# Altium schematic sheet T245_1v1.SchDoc
size 254 x 203 mm; Author: Aurimas Vilkas; DrawnBy: Aurimas Vilkas; Engineer: Aurimas Vilkas
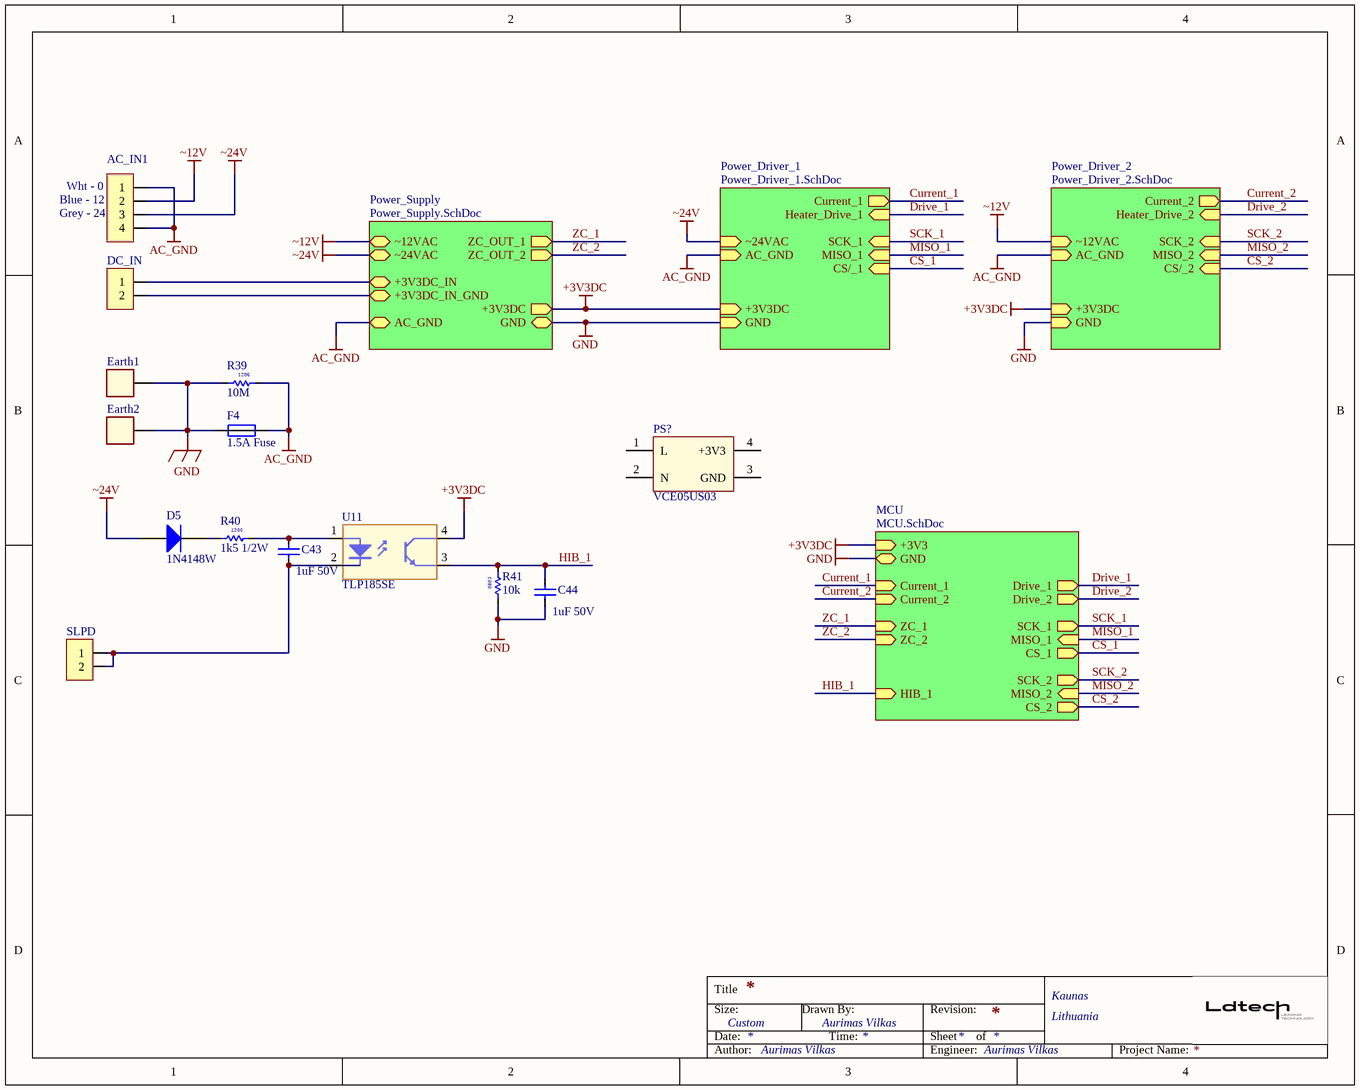
[diagram p0: T245_1v1.SchDoc]

## Parts
AC_IN1  HDR1X4  [HDR1X4_3M96V]  (value not drawn)
C43  1uF 50V  [CAPC2012N]
C44  1uF 50V  [CAPC2012N]
D5  1N4148W  [SOD-123F]
DC_IN  HDR1X2  [HDR1X2_3M96V]  (value not drawn)
Earth1  Blade Header  [Blade header]  (value not drawn)
Earth2  Blade Header  [Blade header]  (value not drawn)
F4  1.5A Fuse  [1206F]
PS?  VCE05US03  [VCE05US03]
R39  10M  [RESC3216N]
R40  1k5 1/2W  [RESC3216N]
R41  10k  [RESC1608N]
SLPD  Sleep_Det  [HDR1X2_2.54mm]  (value not drawn)
U11  TLP185SE  [SOP-4]

## Sub-sheets
MCU = MCU.SchDoc: SCK_2 (out), +3V3 (in), Current_1 (in), Drive_2 (out), CS_1 (out), Current_2 (in), MISO_1 (in), MISO_2 (in), ZC_2 (in), CS_2 (out), SCK_1 (out), ZC_1 (in), Drive_1 (out), GND (bidir), HIB_1 (in)
Power_Driver_1 = Power_Driver_1.SchDoc: GND (in), ~24VAC (in), Current_1 (out), SCK_1 (in), +3V3DC (in), AC_GND (in), Heater_Drive_1 (in), CS/_1 (in), MISO_1 (in)
Power_Driver_2 = Power_Driver_2.SchDoc: Current_2 (out), Heater_Drive_2 (in), +3V3DC (in), AC_GND (in), MISO_2 (in), GND (in), CS/_2 (in), SCK_2 (in), ~12VAC (in)
Power_Supply = Power_Supply.SchDoc: +3V3DC (out), GND (bidir), ~24VAC (bidir), AC_GND (bidir), ZC_OUT_2 (out), ZC_OUT_1 (out), +3V3DC_IN (bidir), +3V3DC_IN_GND (bidir), ~12VAC (bidir)

## Nets
+3V3DC: U11.4(C) ; sheet MCU/+3V3, sheet Power_Supply/+3V3DC, sheet Power_Driver_1/+3V3DC, sheet Power_Driver_2/+3V3DC
AC_GND: AC_IN1.1 AC_IN1.4 F4.1 R39.2 ; sheet Power_Supply/AC_GND, sheet Power_Driver_1/AC_GND, sheet Power_Driver_2/AC_GND
GND: C44.2 Earth1.1 Earth2.1 F4.2 R39.1 R41.1 ; sheet MCU/GND, sheet Power_Supply/GND, sheet Power_Driver_1/GND, sheet Power_Driver_2/GND
~12V: AC_IN1.2 ; sheet Power_Supply/~12VAC, sheet Power_Driver_2/~12VAC
~24V: AC_IN1.3 D5.2 ; sheet Power_Supply/~24VAC, sheet Power_Driver_1/~24VAC
CS_1: sheet MCU/CS_1, sheet Power_Driver_1/CS/_1
CS_2: sheet MCU/CS_2, sheet Power_Driver_2/CS/_2
Current_1: sheet MCU/Current_1, sheet Power_Driver_1/Current_1
Current_2: sheet MCU/Current_2, sheet Power_Driver_2/Current_2
Drive_1: sheet MCU/Drive_1, sheet Power_Driver_1/Heater_Drive_1
Drive_2: sheet MCU/Drive_2, sheet Power_Driver_2/Heater_Drive_2
HIB_1: C44.1 R41.2 U11.3(E) ; sheet MCU/HIB_1
MISO_1: sheet MCU/MISO_1, sheet Power_Driver_1/MISO_1
MISO_2: sheet MCU/MISO_2, sheet Power_Driver_2/MISO_2
SCK_1: sheet MCU/SCK_1, sheet Power_Driver_1/SCK_1
SCK_2: sheet MCU/SCK_2, sheet Power_Driver_2/SCK_2
ZC_1: sheet MCU/ZC_1, sheet Power_Supply/ZC_OUT_1
ZC_2: sheet MCU/ZC_2, sheet Power_Supply/ZC_OUT_2
NetC43_1: C43.1 R40.2 U11.1(A)
NetC43_2: C43.2 SLPD.1 SLPD.2 U11.2(K)
NetD5_1: D5.1 R40.1
NetDC_IN_1: DC_IN.1 ; sheet Power_Supply/+3V3DC_IN
NetDC_IN_2: DC_IN.2 ; sheet Power_Supply/+3V3DC_IN_GND

Not connected (* = marked no-connect by the designer): PS? 1(L) 2(N) 3(GND) 4(+3V3)

## Notes on the sheet
- (near AC_IN1) Blue - 12
- (near AC_IN1) Grey - 24
- (near AC_IN1) Wht - 0
- Title
- Size:
- Date:
- Custom
- Drawn By:
- Time:
- Revision:
- Sheet
- of
- Kaunas
- Lithuania
- Author:
- Engineer:
- Project Name:
- (in symbol R0000008) 0603
- (in symbol R2412076) 1206
- (in symbol R2412168) 1206

## Library data of the parts
AC_IN1 = J0000151: CONNECTOR, 4 way , HEADER, THT, 3.96MM,10A,250Vac; Supplier 1: Farnell; Supplier Part Number 1: 9492020
C43 C44 = C0000037: CL21B105KBFNNNE -  SMD Multilayer Ceramic Capacitor, 1 µF, 50 V, 0805 [2012 Metric], ± 10%, X7R, CL Series; Supplier 1: Farnell; Supplier Part Number 1: 3013482
D5 = 1N4148W: 1N4148W -  Small Signal Diode, Single, 75 V, 150 mA, 1 V, 4 ns, 400 mA; Supplier Part Number 1: 2677464; Supplier: Farnell
DC_IN = J0000152: CONNECTOR, 2 way , HEADER, THT, 3.96MM,10A,250Vac; Supplier 1: Farnell; Supplier Part Number 1: 9492003
Earth1 Earth2 = Blade Header: 62409-1 -  PCB Terminal, 6.35mm x 0.81mm, 0.25" x 0.032", Brass, 1.4 mm, Tin; Supplier 1: Farnell; Supplier Part Number 1: 892609
F4 = 1.5A Fuse: MCCFB1206TFF/1.5 -  Fuse, Surface Mount, 1.5 A, 32 V, Fast Acting, 1206; Supplier 1: Farnell; Supplier Part Number 1: 1652166
PS? = VCE05US03: VCE05US03 -  AC/DC PCB Mount Power Supply (PSU), ITE, 1 Output, 5 W, 3.3 V, 1.21 A; Supplier 1: Farnell; Supplier Part Number 1: 2671557
R39 = R2412168: CRGCQ1206J10M -  SMD Chip Resistor, 1206 [3216 Metric], 10 Mohm, CRGCQ Series, 200 V, Thick Film, 250 mW; Supplier 1: Farnell; Supplier Part Number 1: 2861974
R40 = R2412076: MCWF12P1501FTL -  SMD Chip Resistor, 1206 [3216 Metric], 1.5 kohm, MCWF12P Series, 200 V, Thick Film, 500 mW; Supplier 1: Farnell; Supplier Part Number 1: 2694448
R41 = R0000008: MCWR06X1002FTL -  SMD Chip Resistor, 0603 [1608 Metric], 10 kohm, MCWR Series, 50 V, Thick Film, 100 mW; Supplier 1: Farnell; Supplier Part Number 1: 2447230
SLPD = J0000013: 2 header, 2.54mm; Supplier 1: Farnell; Supplier Part Number 1: 1248140
U11 = TLP185SE: TLP185(GR-TPL,SE(T -  Optocoupler, 1 Channel, SOP, 4 Pins, 50 mA, 3.75 kV, 100 %; Supplier 1: Farnell; Supplier Part Number 1: 3014097